# EAGLE design uv-dosimeter-guva-op-amp-mk-1.3 (EAGLE 7.5.0)
AUTHOR: sean@yak.net
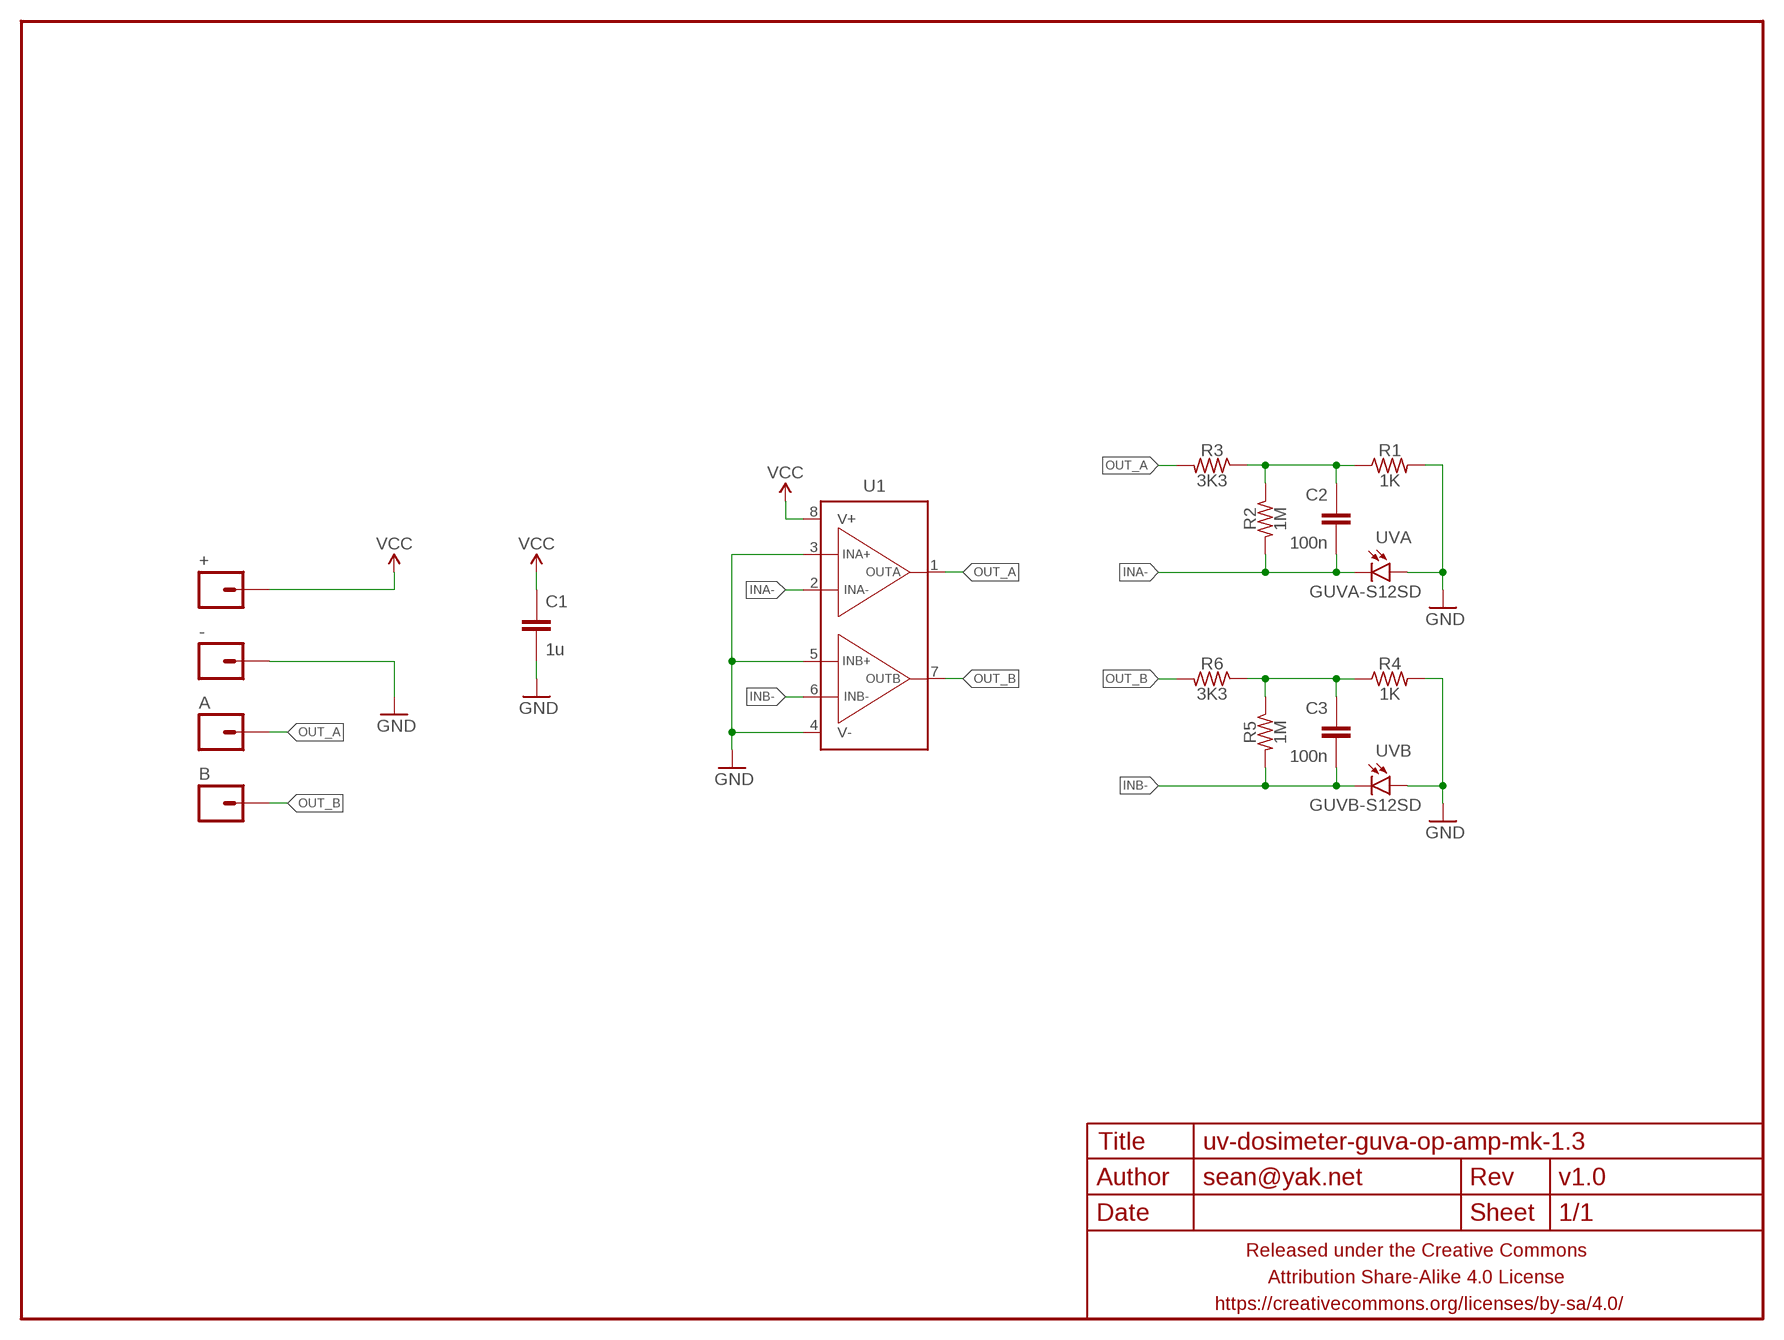
[diagram p0: schematic, sheet 1]

## Parts
+  M01PTH  [1X01]
-  M01PTH  [1X01]
A  M01PTH  [1X01]
B  M01PTH  [1X01]
C1  1u  CAPACITOR-CERAMICC0603  [C0603]
C2  100n  CAPACITOR-CERAMICC0603  [C0603]
C3  100n  CAPACITOR-CERAMICC0603  [C0603]
FRAME1  FRAME-LETTERNO_PACKAGE  [DUMMY]
R1  1K  RESISTORR0603  [R0603]
R2  1M  RESISTORR0603  [R0603]
R3  3K3  RESISTORR0603  [R0603]
R4  1K  RESISTORR0603  [R0603]
R5  1M  RESISTORR0603  [R0603]
R6  3K3  RESISTORR0603  [R0603]
U1  MCP6002MSOP  [MSOP-8]
UVA  GUVA-S12SD  GUVA-S12SDLED3528  [LED3528]
UVB  GUVB-S12SD  GUVA-S12SDLED3528  [LED3528]

## Nets
GND: -.1 C1.2 R1.2 R4.2 U1.3(INA+) U1.4(V-) U1.5(INB+) UVA.A UVB.A
INA-: C2.2 R2.2 U1.2(INA-) UVA.K(C)
INB-: C3.2 R5.2 U1.6(INB-) UVB.K(C)
N$2: C2.1 R1.1 R2.1 R3.1
N$4: C3.1 R4.1 R5.1 R6.1
OUT_A: A.1 R3.2 U1.1(OUTA)
OUT_B: B.1 R6.2 U1.7(OUTB)
VCC: +.1 C1.1 U1.8(V+)

## Library data of the parts
+ - A B = a_parts:M01: Header 1 Standard 1-pin 0.1" header. Use with straight break away headers (SKU : PRT-00116), right angle break away headers (PRT-00553), swiss pins (PRT-00743), machine pins (PRT-00117), and female headers (PRT-00115).
C1-C3 = a_parts:CAPACITOR-CERAMIC: CAPACITOR, European symbol
FRAME1 = A_butts:FRAME-LETTER: Schematic Frame Standard 8.5x11 US Letter frame; DESIGNER: sean@yak.net; VERSION: v1.0
R1-R6 = a_parts:RESISTOR: RESISTOR, American symbol
U1 = a_parts:MCP6002
UVA UVB = a_parts:GUVA-S12SD

## Board
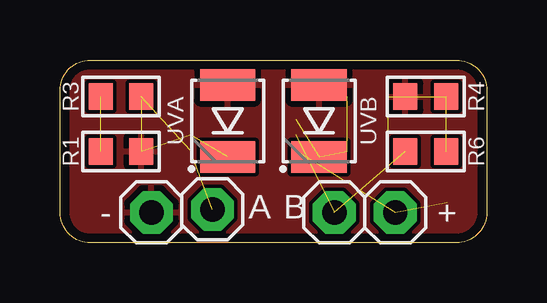
[diagram p1: board, top side]
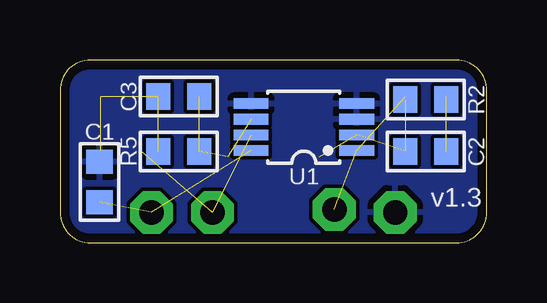
[diagram p2: board, bottom side, seen from below]

Size 17.78 x 7.62 mm. Coordinates in mm from the lower left corner, seen from the top.
Outline: 16.51,0 1.27,0 arc-90 0,1.27 0,6.35 arc-90 1.27,7.62 16.51,7.62 arc-90 17.78,6.35 17.78,1.27 arc-90 16.51,0
Copper layers (1*16): Top 0.0356mm / dielectric 1.5011mm / Bottom 0.0356mm
Design rules "LaenPCBOrder_2": minimum track width 6mil, minimum drill 13mil, track to track 6mil, track to pad 6mil, pad to pad 6mil, via to via 6mil, smd to smd 6mil, copper to edge 15mil, drill to drill 6mil, minimum pad ring 7mil, minimum via ring 7mil, stop-mask expansion 3mil, vias tented up to drill 20mil, thermal gap 10mil

### Footprints (pad centres in the part's own frame; a part is rotated, then mirrored left to right if it is on the bottom)
1X01 = drill 1.016 pad 1.778 octagon: 1 0,0
C0603 = smd 1 x 1.1: 1 -0.85,0; 2 0.85,0
R0603 = smd 1 x 1.1: 1 -0.85,0; 2 0.85,0
MSOP-8 = smd 1.45 x 0.44: 1 -2.2,0.975; 2 -2.2,0.325; 3 -2.2,-0.325; 4 -2.2,-0.975; 5 2.2,-0.975; 6 2.2,-0.325; 7 2.2,0.325; 8 2.2,0.975
LED3528 = smd 2.3 x 1.3: A 0,-1.5; K 0,1.5

### Placement (x,y rotation side)
+  13.97,1.27 0 top
-  3.81,1.27 0 top
A  6.35,1.4 0 top
B  11.43,1.27 0 top
C1  16.13,2.54 90 bottom
C2  2.54,3.81 180 bottom
C3  12.83,6.1 0 bottom
FRAME1  0,0 90 bottom
R1  2.54,3.81 0 top
R2  2.54,5.97 180 bottom
R3  2.54,6.1 0 top
R4  15.24,6.1 180 top
R5  12.83,3.81 0 bottom
R6  15.24,3.81 180 top
U1  7.62,4.83 180 bottom
UVA  6.99,5.08 180 top
UVB  10.79,5.08 180 top

### Tracks (layer width: path | path; a pad name or v marks a point on that pad's centre or on a via)
GND
  pour Bottom (rank 6): 16.51,0 1.27,0 arc-90 0,1.27 0,6.35 arc-90 1.27,7.62 16.51,7.62 arc-90 17.78,6.35 17.78,1.27 arc-90
  pour Top: 16.51,0 1.27,0 arc-90 0,1.27 0,6.35 arc-90 1.27,7.62 16.51,7.62 arc-90 17.78,6.35 17.78,1.27 arc-90
INA-  (3 unrouted)
INB-  (3 unrouted)
N$2  (3 unrouted)
N$4  (3 unrouted)
OUT_A  (2 unrouted)
OUT_B  (2 unrouted)
VCC  (2 unrouted)